# Altium schematic sheet Experiment 1 0.0.0.SchDoc
size A4; Organization: Altium Limited; Address1: L3, 12a Rodborough Rd; Address2: Frenchs Forest; Address3: NSW; Address4: Australia 2086; DocumentNumber: 1; SheetNumber: 1; SheetTotal: 5
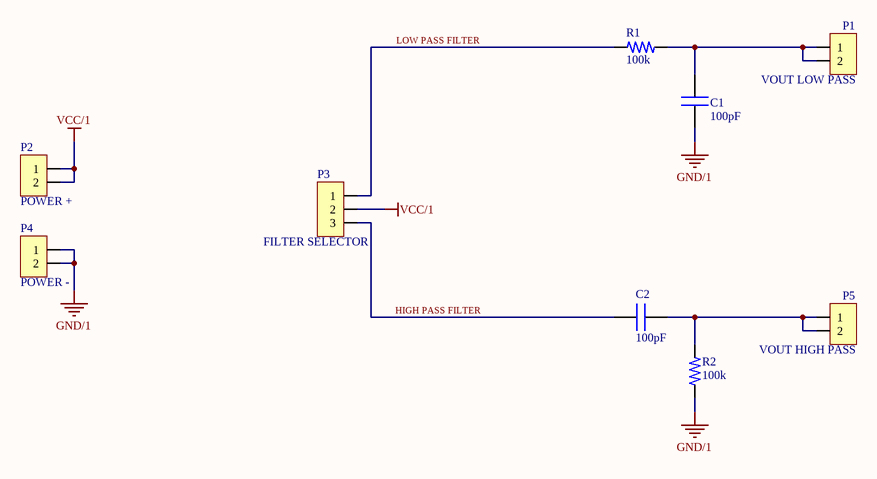
[diagram p0: Experiment 1 0.0.0.SchDoc]

## Parts
C1  100pF  [CAP-H5]
C2  100pF  [CAP-H5]
P1  VOUT LOW PASS  [PINHD-1X02 ONCE]
P2  POWER +  [PINHD-1X02 ONCE]
P3  FILTER SELECTOR  [PINHD-1X03]
P4  POWER -  [PINHD-1X02 ONCE]
P5  VOUT HIGH PASS  [PINHD-1X02 ONCE]
R1  100k  [R Axial 0.25]
R2  100k  [R Axial 0.25]

## Nets
GND/1: C1.2 P4.1 P4.2 R2.1
VCC/1: P2.1 P2.2 P3.2
NetC1_1: C1.1 P1.1 P1.2 R1.2
NetC2_1: C2.1 P3.3
NetC2_2: C2.2 P5.1 P5.2 R2.2
NetP3_1: P3.1 R1.1

## Notes on the sheet
- LOW PASS FILTER
- HIGH PASS FILTER
- Elivelton Santos
- https://github.com/eliveltonpsantos
- Project:
- Sheet:
- Date:
- Time:
- Sheet
- of
- File:

## Library data of the parts
C1 C2 = K101K10X7RF5UH5: CAP CER 100PF 50V X7R RADIAL; Manufacturer: Vishay BC Components; Tolerance: ±10%; Category: Capacitors; Manufacturer Part Number: K101K10X7RF5UH5; Package / Case: 0.142" L x 0.091" W (3.60mm x 2.30mm); Capacitance: 100pF; Voltage: 50V; Supplier 1: Digi-Key; Supplier Part Number 1: BC2657CT-ND
P1 P2 P4 P5 = PIN HEADER 1X02 ONCE: CONN HEADER 2POS .100" STR TIN; Manufacturer: Molex, LLC; Manufacturer Part Number: 0901200122; Category: Connectors; Supplier 1: Digi-Key; Supplier Part Number 1: WM8072-ND
P3 = PIN HEADER 1X03: CONN HEADER 3POS .100" STR TIN; Manufacturer: Molex, LLC; Manufacturer Part Number: 0901200123; Category: Connectors; Supplier 1: Digi-Key; Supplier Part Number 1: WM8073-ND
R1 R2 = CFR-25JB-52-100K: RES 100K OHM 1/4W 5% AXIAL; Manufacturer: Yageo; Power (Watts): 0.25W, 1/4W; Resistance (Ohms): 10k; Category: Resistors; Manufacturer Part Number: CFR-25JB-52-100K; Package / Case: Axial; Tolerance: ±5%; Supplier 1: Digi-Key; Supplier Part Number 1: 100KQBK-ND